# Altium schematic sheet 1_ADSTM32_Power.SchDoc
size A; SheetNumber: 2; SheetTotal: 4
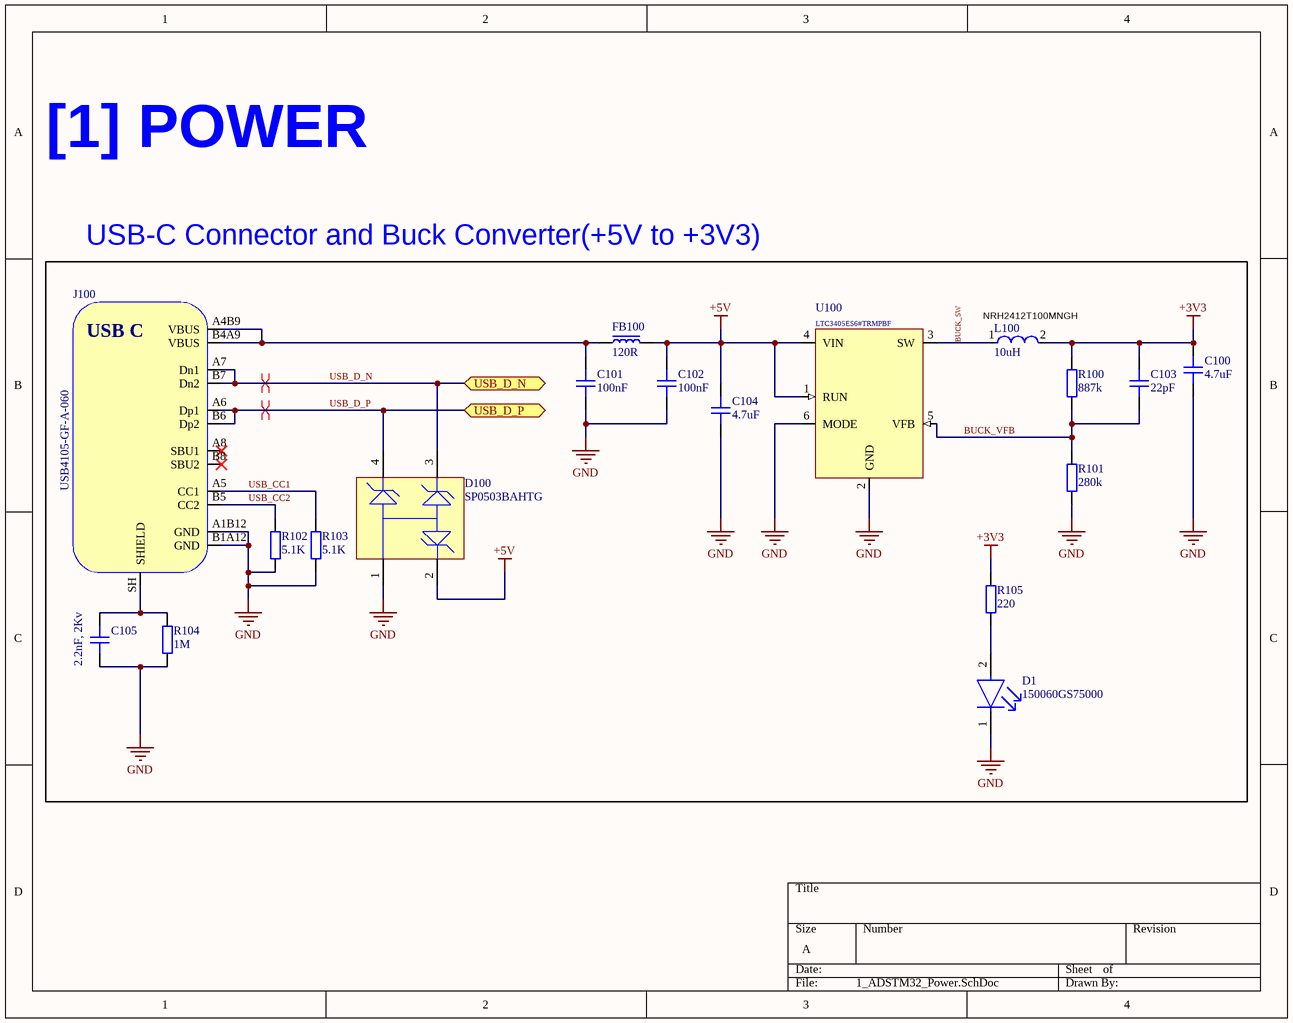
[diagram p0: 1_ADSTM32_Power.SchDoc]

## Parts
C100  4.7uF  [CAP_0603]
C101  100nF  [CAP_0603]
C102  100nF  [CAP_0603]
C103  22pF  [CAP_0603]
C104  4.7uF  [CAP_0603]
C105  2.2nF, 2Kv  [CAP_0603]
D1  150060GS75000  [FP-150060GS75000-MFG]
D100  SP0503BAHTG  [LFUS-SOT143-4_V]
FB100  120R  [FB_0603]
J100  USB4105-GF-A-060  [USB4105-GF-A-060]
L100  10uH  [FP-NRH2412-MFG]
R100  887k  [RES_0603]
R101  280k  [RES_0603]
R102  5.1K  [RES_0603]
R103  5.1K  [RES_0603]
R104  1M  [RES_0603]
R105  220  [RES_0603]
U100  LTC3405ES6#TRMPBF  [SOT-23-6]

## Blocks framed on the sheet
NRH2412T100MNGH: C100-C105 D1 D100 FB100 J100 L100 R100-R105 U100

## Ports
USB_D_N (bidir, see 0_ADSTM32_Overview[2B], 2_ADSTM32_MCU[1B]), USB_D_P (bidir, see 0_ADSTM32_Overview[2B], 2_ADSTM32_MCU[1B])

## Nets
+3V3: C100.2 C103.2 L100.2 R100.2 R105.2
+5V: C102.2 C104.2 D100.2 FB100.2 U100.1(RUN) U100.4(VIN)
GND: C100.1 C101.1 C102.1 C104.1 C105.2 D1.1(C) D100.1 J100.A1B12(GND) J100.B1A12(GND) R101.1 R102.2 R103.2 R104.2 U100.2(GND) U100.6(MODE)
BUCK_SW: L100.1 U100.3(SW)
BUCK_VFB: C103.1 R100.1 R101.2 U100.5(VFB)
USB_CC1: J100.A5(CC1) R103.1
USB_CC2: J100.B5(CC2) R102.1
USB_D_N: D100.3 J100.A7(Dn1) J100.B7(Dn2) ; port USB_D_N
USB_D_P: D100.4 J100.A6(Dp1) J100.B6(Dp2) ; port USB_D_P
NetC101_2: C101.2 FB100.1 J100.A4B9(VBUS) J100.B4A9(VBUS)
NetC105_1: C105.1 J100.SH(SHIELD) R104.1
NetD1_2: D1.2(A) R105.1

Not connected (* = marked no-connect by the designer): J100 A8(SBU1)* B8(SBU2)*

## Layout directives
differential pair; differential pair class USB_D: USB_D_N
differential pair; differential pair class USB: USB_D_P

## Notes on the sheet
- [1] POWER
- USB-C Connector and Buck Converter(+5V to +3V3)
- (in symbol USB4105-GF-A-060) USB C

## Library data of the parts
C100 C104 C105 = CAP_0805_16V: Capacitor SMD 0805 16V
C101-C103 = CAP_0603_16V: Capacitor SMD 0603 16V
D1 = CMP-1426-00002-2: LED GREEN CLEAR 0603 SMD; Viewing Angle: 140°; Forward Current: 30mA; Dominant Wavelength: 520nm; Luminous Intensity: 430mcd; Lens Size: 0.7mm; Forward Voltage: 3.2V; Test Current: 20mA; Lens Color: Colorless; Case Code (Imperial): 0603; Case/Package: 0603; Case Code (Metric): 1608; Length: 1.6mm; Lens Style: Clear; Height: 0.8mm; RoHS Compliant: Yes; Package Quantity: 1; Max Operating Temperature: 85°C; Mount: Surface Mount; Wavelength: 520nm; Width: 0.8mm; Lens Transparency: Clear; Packaging: Cut Tape; Color: Green; Lead Free: Lead Free; Min Operating Temperature: -40°C; Series: WL-SMCW
D100 = CMP-2000-05191-1: TVS Diode Array, 30 pF, 30 KV, -40 to 85 degC, 4-Pin SOT143, RoHS, Tape and Reel; Manufacturer: Littelfuse; Direction Type: Uni-Directional; Product Height (mm): 1.05mm; Leakage Current (Max): 0.1uA; Clamping Voltage (Max): 8V; Reverse Stand-off Voltage: 5.5(Min)V; Configuration: Triple; Working Voltage: 5.5V; Product Length (mm): 3.04mm; Working Voltage (Max): 5.5V(Min); Capacitance Value: 30pF; Rad Hardened: No; Number of Elements: 3; Product Depth (mm): 1.4mm; Operating Temperature Max Deg. C: 85C; Suppressor Type: TVS; Operating Temperature Min Deg. C: -40C; Operating Temp Range: -40Cto85C; Mounting: SurfaceMount; Package / Case: SOT-143; Datasheet Version: Dec-13; Package Type: SOT-143; Packaging: TapeandReel; Pin Count: 3+Tab; Operating Temperature Classification: Industrial; Datasheet URL: https://datasheet.ciiva.com/15143/getdatasheetpartid-116020-15143550.pdf; Manufacturer URL: http://www.littelfuse.com/; Leakage Current: 0.1uA; Mounting Style: SurfaceMount; Clamping Voltage: 8V; Polarity: Uni-Directional
FB100 = FB_0603: Ferrite Bead SMD 0603
J100 = USB4105-GF-A-060: USB Connector Type C SMT 12 Pin; Manufacturer: GCT; Manufacturer Part Number: USB4105-GF-A-060
L100 = CMP-14484-000582-1: NRH2412T100MNGH -Shielded Wirewound Inductor 10uH 20% 0.51A 0.72Ω SMD; DC Resistance (DCR): 600mR; Current Rating: 450mA; Saturation Current: 810mA; Core Material: Ferrite; Test Frequency: 100kHz; Self Resonant Frequency: 29MHz; Termination: SMD/SMT; Shielding: Shielded; Height - Seated (Max): 0.047inch; Case/Package: Nonstandard; Tolerance: 20%; Height: 1.2mm; Package Quantity: 2500; Mount: Surface Mount; Min Operating Temperature: -25°C; Inductance: 10uH; Width: 0.095inch; Length: 0.095inch; RoHS Compliant: Yes; Max DC Current: 810mA; Packaging: Tape and Reel; Max Operating Temperature: 120°C; Halogen Free: Halogen Free
R100-R103 R105 = RES_0603: Resistor SMD 0603; Manufacturer: *; Manufacturer Part Number: *; Distributor Link: *
R104 = RES_0805: Resistor SMD 0805; Manufacturer: *; Manufacturer Part Number: *; Distributor Link: *
U100 = LTC3405ES6#TRMPBF: 1.5MHz, 300mA / Synchronous Step-Down / Regulator in ThinSOT; Manufacturer: Analog Devices; Manufacturer Part Number: LTC3405ES6#TRMPBF